# Altium project Li_Test.PrjPcb
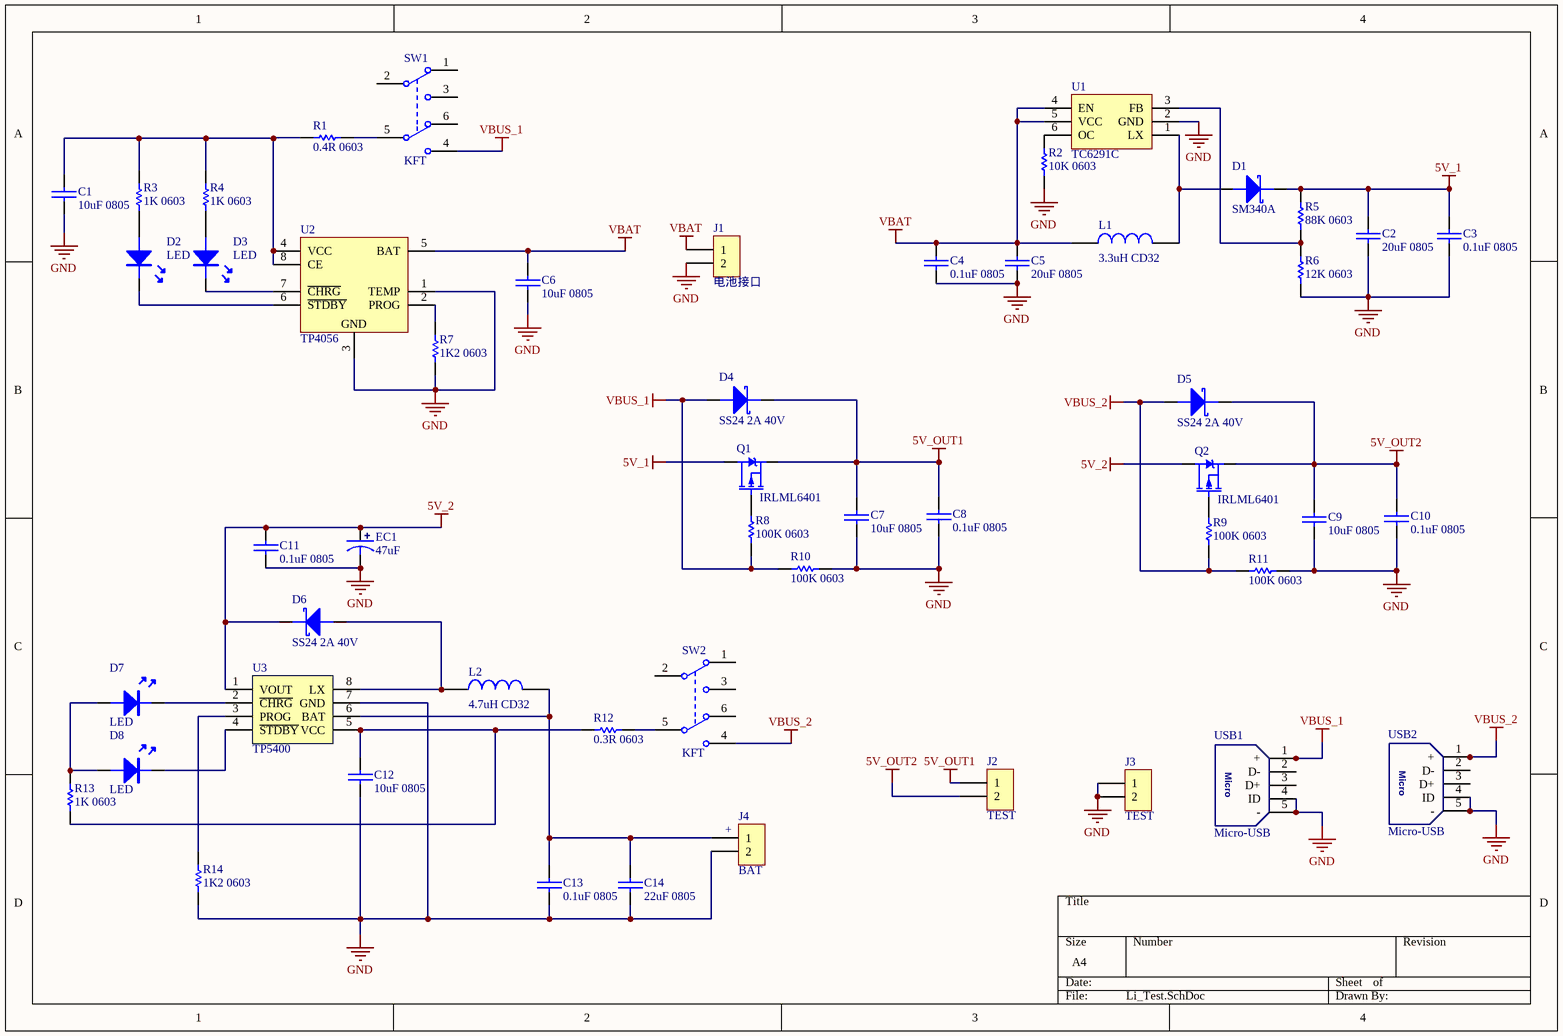
[diagram p0: Li_Test.SchDoc]
1 sheet, 52 parts. Net scope: global (net labels, ports and power ports of the same name join across sheets).
Board file: Li_Test.PcbDoc

## Sheet Li_Test.SchDoc
size A4

### Parts
C1  10uF 0805  [0805C]
C2  20uF 0805  [0805C]
C3  0.1uF 0805  [0805C]
C4  0.1uF 0805  [0805C]
C5  20uF 0805  [0805C]
C6  10uF 0805  [0805C]
C7  10uF 0805  [0805C]
C8  0.1uF 0805  [0805C]
C9  10uF 0805  [0805C]
C10  0.1uF 0805  [0805C]
C11  0.1uF 0805  [0805C]
C12  10uF 0805  [0805C]
C13  0.1uF 0805  [0805C]
C14  22uF 0805  [0805C]
D1  SM340A  [SMA/DO-214AC]
D2  LED  [LED-0805G]
D3  LED  [LED-0805R]
D4  SS24 2A 40V  [SMA/DO-214AC]
D5  SS24 2A 40V  [SMA/DO-214AC]
D6  SS24 2A 40V  [SMA/DO-214AC]
D7  LED  [LED-0805R]
D8  LED  [LED-0805G]
EC1  47uF  [SMD-EC4.0X4.3X5.4]
J1  电池接口  [Fe-HDR1X2/2.54-S]
J2  TEST  [Fe-HDR1X2/2.54-S]
J3  TEST  [Fe-HDR1X2/2.54-S]
J4  BAT  [Fe-HDR1X2/2.54-S]
L1  3.3uH CD32  [CD32]
L2  4.7uH CD32  [CD32]
Q1  IRLML6401  [SOT23]
Q2  IRLML6401  [SOT23]
R1  0.4R 0603  [0603R]
R2  10K 0603  [0603R]
R3  1K 0603  [0603R]
R4  1K 0603  [0603R]
R5  88K 0603  [0603R]
R6  12K 0603  [0603R]
R7  1K2 0603  [0603R]
R8  100K 0603  [0603R]
R9  100K 0603  [0603R]
R10  100K 0603  [0603R]
R11  100K 0603  [0603R]
R12  0.3R 0603  [0603R]
R13  1K 0603  [0603R]
R14  1K2 0603  [0603R]
SW1  KFT  [KFT DIP-7X7]
SW2  KFT  [KFT DIP-7X7]
U1  TC6291C  [SOT23-6]
U2  TP4056  [SOP8]
U3  TP5400  [SOIC8]
USB1  Micro-USB  [USB-micro_C]
USB2  Micro-USB  [USB-micro_C]

### Nets
5V_1: C2.2 C3.2 D1.K Q1.D R5.2
5V_2: C11.2 D6.K EC1.1 Q2.D U3.1(VOUT)
5V_OUT1: C7.1 C8.1 D4.K J2.1 Q1.S
5V_OUT2: C9.1 C10.1 D5.K J2.2 Q2.S
GND: C1.1 C2.1 C3.1 C4.1 C5.1 C6.2 C7.2 C8.2 C9.2 C10.2 C11.1 C12.1 C13.1 C14.1 EC1.2 J1.2 J3.1 J3.2 J4.2 R2.1 R6.1 R7.2 R10.1 R11.1 R14.2 U1.2(GND) U2.1(TEMP) U2.3(GND) U3.7(GND) USB1.4(ID) USB1.5(-) USB2.4(ID) USB2.5(-)
VBAT: C4.2 C5.2 C6.1 J1.1 L1.1 U1.4(EN) U1.5(VCC) U2.5(BAT)
VBUS_1: D4.A R8.2 R10.2 SW1.4(NO2) USB1.1(+)
VBUS_2: D5.A R9.2 R11.2 SW2.4(NO2) USB2.1(+)
NetC1_2: C1.2 R1.2 R3.1 R4.1 U2.4(VCC) U2.8(CE)
NetC12_2: C12.2 R12.2 R13.1 U3.5(VCC)
NetC13_2: C13.2 C14.2 J4.1 L2.2 U3.6(BAT)
NetD1_A: D1.A L1.2 U1.1(LX)
NetD2_A: D2.A R3.2
NetD2_K: D2.K U2.6(~{STDBY})
NetD3_A: D3.A R4.2
NetD3_K: D3.K U2.7(~{CHRG})
NetD6_A: D6.A L2.1 U3.8(LX)
NetD7_A: D7.A D8.A R13.2
NetD7_K: D7.K U3.2(~{CHRG})
NetD8_K: D8.K U3.4(~{STDBY})
NetQ1_G: Q1.G R8.1
NetQ2_G: Q2.G R9.1
NetR1_1: R1.1 SW1.5(COM2)
NetR2_2: R2.2 U1.6(OC)
NetR5_1: R5.1 R6.2 U1.3(FB)
NetR7_1: R7.1 U2.2(PROG)
NetR12_1: R12.1 SW2.5(COM2)
NetR14_1: R14.1 U3.3(PROG)

Not connected (* = marked no-connect by the designer): SW1 1(NC1) 2(COM2) 3(NO1) 6(NC2); SW2 1(NC1) 2(COM2) 3(NO1) 6(NC2); USB1 2(D-) 3(D+); USB2 2(D-) 3(D+)

### Notes on the sheet
- (near J4) +
- (in symbol Micro-USB) Micro

### Library data of the parts
C1-C14 = CAP: 无极性电容
D1 D4-D6 = DIODE SCHOTTKY: 肖特基二极管
EC1 = SMD_ECAP: 贴片电解电容
J1-J4 = Female HDR1X2
L1 L2 = INDUCTOR
Q1 Q2 = P-MOS: P沟道场效应管
R1-R14 = RES
SW1 SW2 = KFT_7X7-DIP: Self-locking Switch
U1 = TC6291C: DC-DC升压IC